# Altium schematic sheet HSADCircuit.SchDoc
size A4; SheetNumber: 4; SheetTotal: 6
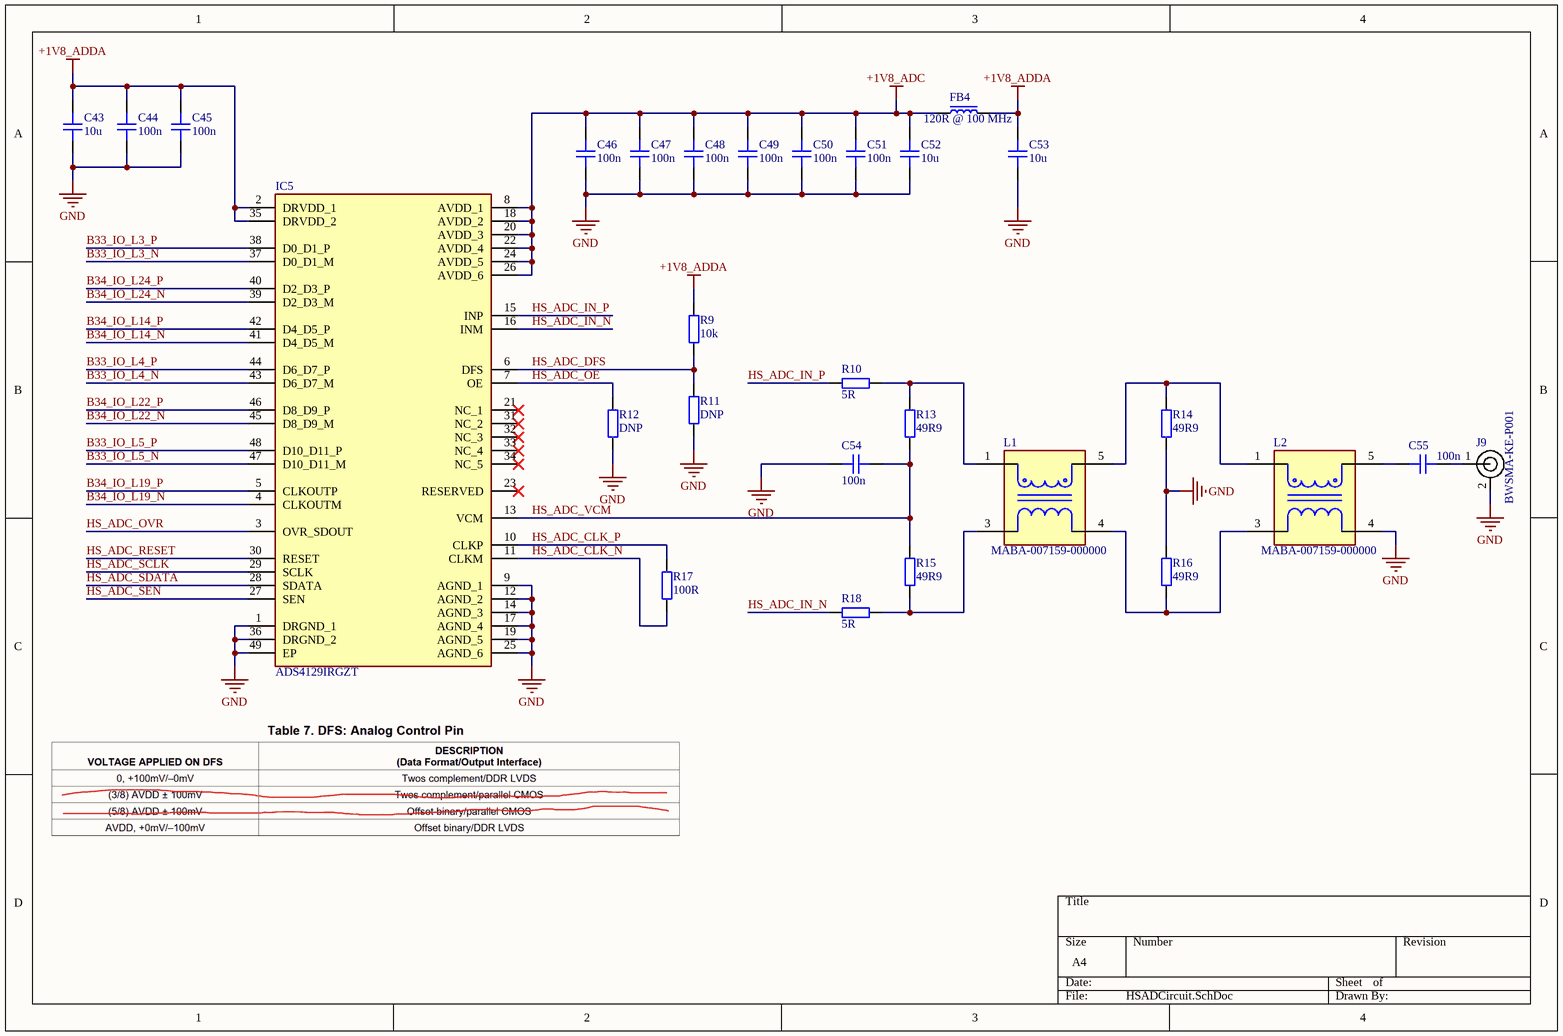
[diagram p0: HSADCircuit.SchDoc]

## Parts
C43  10u  [CAP_0603]
C44  100n  [CAP_0402]
C45  100n  [CAP_0402]
C46  100n  [CAP_0402]
C47  100n  [CAP_0402]
C48  100n  [CAP_0402]
C49  100n  [CAP_0402]
C50  100n  [CAP_0402]
C51  100n  [CAP_0402]
C52  10u  [CAP_0603]
C53  10u  [CAP_0603]
C54  100n  [CAP_0402]
C55  100n  [CAP_0402]
FB4  120R @ 100 MHz  [FB_0603]
IC5  ADS4129IRGZT  [QFN50P700X700X100-49N-D]
J9  BWSMA-KE-P001  [BWSMA-KE-P001]
L1  MABA-007159-000000  [FP-MABA-007159-000000-MFG]
L2  MABA-007159-000000  [FP-MABA-007159-000000-MFG]
R9  10k  [RES_0402]
R10  5R  [RES_0402]
R11  DNP  [RES_0402]
R12  DNP  [RES_0402]
R13  49R9  [RES_0402]
R14  49R9  [RES_0402]
R15  49R9  [RES_0402]
R16  49R9  [RES_0402]
R17  100R  [RES_0402]
R18  5R  [RES_0402]

## Nets
+1V8_ADC: C46.1 C47.1 C48.1 C49.1 C50.1 C51.1 C52.2 FB4.1 IC5.8(AVDD_1) IC5.18(AVDD_2) IC5.20(AVDD_3) IC5.22(AVDD_4) IC5.24(AVDD_5) IC5.26(AVDD_6)
+1V8_ADDA: C43.2 C44.1 C45.1 C53.2 FB4.2 IC5.2(DRVDD_1) IC5.35(DRVDD_2) R9.2
GND: C43.1 C44.2 C45.2 C46.2 C47.2 C48.2 C49.2 C50.2 C51.2 C52.1 C53.1 C54.2 IC5.1(DRGND_1) IC5.9(AGND_1) IC5.12(AGND_2) IC5.14(AGND_3) IC5.17(AGND_4) IC5.19(AGND_5) IC5.25(AGND_6) IC5.36(DRGND_2) IC5.49(EP) J9.2 L2.4(Primary) R11.1 R12.1 R14.2 R16.1
B33_IO_L3_N: IC5.37(D0_D1_M)
B33_IO_L3_P: IC5.38(D0_D1_P)
B33_IO_L4_N: IC5.43(D6_D7_M)
B33_IO_L4_P: IC5.44(D6_D7_P)
B33_IO_L5_N: IC5.47(D10_D11_M)
B33_IO_L5_P: IC5.48(D10_D11_P)
B34_IO_L14_N: IC5.41(D4_D5_M)
B34_IO_L14_P: IC5.42(D4_D5_P)
B34_IO_L19_N: IC5.4(CLKOUTM)
B34_IO_L19_P: IC5.5(CLKOUTP)
B34_IO_L22_N: IC5.45(D8_D9_M)
B34_IO_L22_P: IC5.46(D8_D9_P)
B34_IO_L24_N: IC5.39(D2_D3_M)
B34_IO_L24_P: IC5.40(D2_D3_P)
HS_ADC_CLK_N: IC5.11(CLKM) R17.1
HS_ADC_CLK_P: IC5.10(CLKP) R17.2
HS_ADC_DFS: IC5.6(DFS) R9.1 R11.2
HS_ADC_IN_N: IC5.16(INM) R18.2
HS_ADC_IN_P: IC5.15(INP) R10.2
HS_ADC_OE: IC5.7(OE) R12.2
HS_ADC_OVR: IC5.3(OVR_SDOUT)
HS_ADC_RESET: IC5.30(RESET)
HS_ADC_SCLK: IC5.29(SCLK)
HS_ADC_SDATA: IC5.28(SDATA)
HS_ADC_SEN: IC5.27(SEN)
HS_ADC_VCM: C54.1 IC5.13(VCM) R13.2 R15.1
NetC55_1: C55.1 L2.5(Primary_Dot)
NetC55_2: C55.2 J9.1
NetL1_1: L1.1(Secondary_Dot) R10.1 R13.1
NetL1_3: L1.3(Secondary) R15.2 R18.1
NetL1_4: L1.4(Primary) L2.3(Secondary) R16.2
NetL1_5: L1.5(Primary_Dot) L2.1(Secondary_Dot) R14.1

Not connected (* = marked no-connect by the designer): IC5 21(NC_1)* 23(RESERVED)* 31(NC_2)* 32(NC_3)* 33(NC_4)* 34(NC_5)*

## Library data of the parts
C43 C52 C53 = CAP_0603: Capacitor SMD 0603; Manufacturer: *; Manufacturer Part Number: *; Distributor Link: *; LCSC: *; Rating: *; Dielectric: *
C44-C51 C54 C55 = CAP_0402: Capacitor SMD 0402; Manufacturer: *; Manufacturer Part Number: *; Distributor Link: *; LCSC: *; Rating: *; Dielectric: *
FB4 = FB_0603: Ferrite Bead SMD 0603; Manufacturer: *; Manufacturer Part Number: *; Distributor Link: *; LCSC: *
IC5 = ADS4129IRGZT: Integrated Circuit; Manufacturer_Name: Texas Instruments; Datasheet Link: http://www.ti.com/lit/gpn/ads4129; Height: 1mm; Manufacturer_Part_Number: ADS4129IRGZT; Mouser Part Number: 595-ADS4129IRGZT; Mouser Price/Stock: https://www.mouser.co.uk/ProductDetail/Texas-Instruments/ADS4129IRGZT?qs=%2Fqzd9s%252BcLd6SvRsOYifvuQ%3D%3D; Arrow Part Number: ADS4129IRGZT; Arrow Price/Stock: https://www.arrow.com/en/products/ads4129irgzt/texas-instruments?region=nac
L1 L2 = MABA-007159-000000: BALUN 4.5MHZ-3GHZ 1:1 6SMD FLAT; Power Rating: 250mW; Max DC Current: 30mA; Lead/Base Style: Gull Wing; Depth: 3.81mm; Lead Free: Lead Free; Turns Ratio: 1:1; Case/Package: SMD/SMT; Min Operating Temperature: -40°C; Length: 3.81mm; Width: 3.81mm; Mount: Surface Mount; Radiation Hardening: No; Number of Pins: 5; RoHS Compliant: Yes; Max Operating Temperature: 85°C; Termination: SMD/SMT; Height: 2.67mm; Packaging: Cut Tape; Package Quantity: 2000; Series: -
R9-R18 = RES_0402: Resistor SMD 0402; Manufacturer: *; Manufacturer Part Number: *; Distributor Link: *; LCSC: *